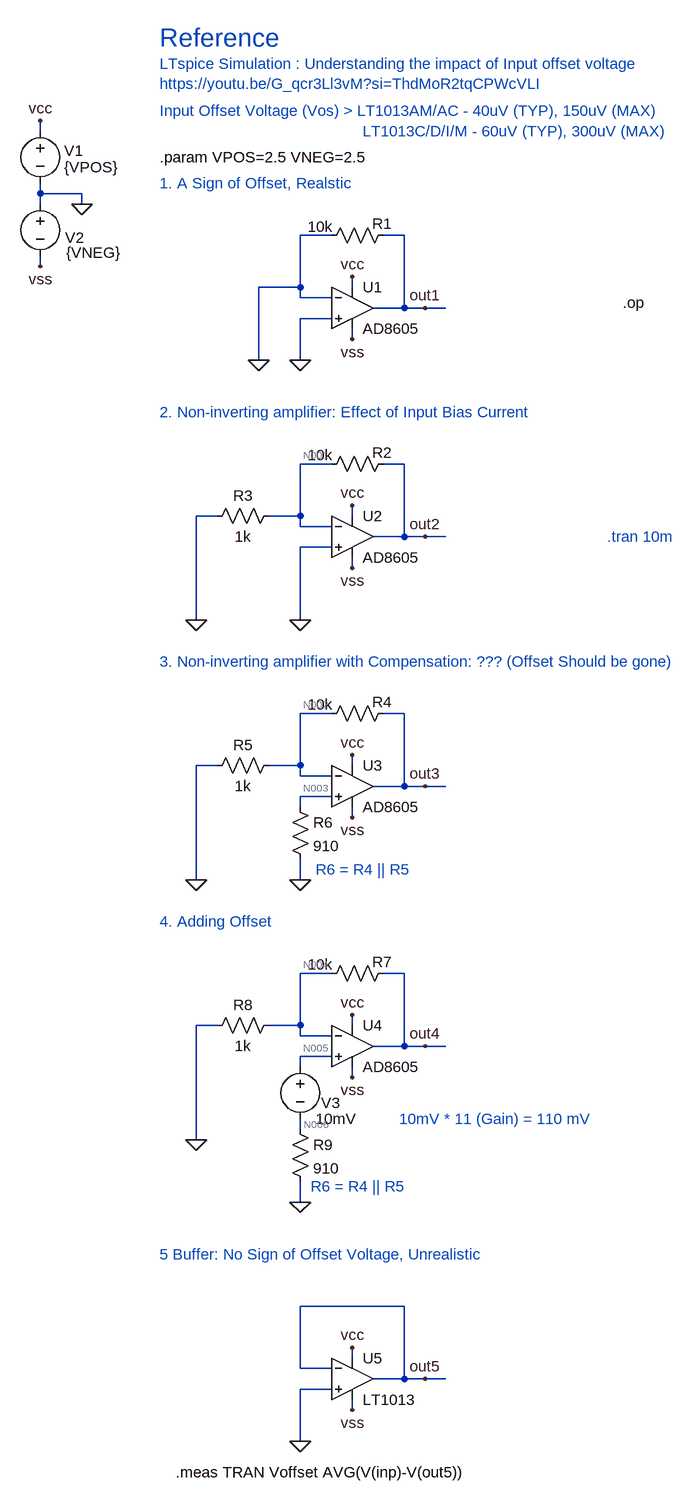
[diagram p0: schematic 05-AD8605_bias current.asc]
05-AD8605_bias current.asc, the LTspice schematic file:
Version 4
SHEET 1 1236 2280
WIRE -256 112 -256 96
WIRE -256 208 -256 192
WIRE -192 208 -256 208
WIRE -256 224 -256 208
WIRE -192 224 -192 208
WIRE 192 272 144 272
WIRE 304 272 272 272
WIRE -256 320 -256 304
WIRE 144 352 144 272
WIRE 144 352 80 352
WIRE 224 352 224 336
WIRE 144 368 144 352
WIRE 192 368 144 368
WIRE 304 384 304 272
WIRE 304 384 256 384
WIRE 336 384 304 384
WIRE 368 384 336 384
WIRE 192 400 144 400
WIRE 224 432 224 416
WIRE 80 464 80 352
WIRE 144 464 144 400
WIRE 192 624 144 624
WIRE 304 624 272 624
WIRE 16 704 -16 704
WIRE 144 704 144 624
WIRE 144 704 96 704
WIRE 224 704 224 688
WIRE 144 720 144 704
WIRE 192 720 144 720
WIRE 304 736 304 624
WIRE 304 736 256 736
WIRE 336 736 304 736
WIRE 368 736 336 736
WIRE 192 752 144 752
WIRE 224 784 224 768
WIRE -16 864 -16 704
WIRE 144 864 144 752
WIRE 192 1008 144 1008
WIRE 304 1008 272 1008
WIRE 16 1088 -16 1088
WIRE 144 1088 144 1008
WIRE 144 1088 96 1088
WIRE 224 1088 224 1072
WIRE 144 1104 144 1088
WIRE 192 1104 144 1104
WIRE 304 1120 304 1008
WIRE 304 1120 256 1120
WIRE 336 1120 304 1120
WIRE 368 1120 336 1120
WIRE 192 1136 144 1136
WIRE 144 1152 144 1136
WIRE 224 1168 224 1152
WIRE -16 1264 -16 1088
WIRE 144 1264 144 1232
WIRE 192 1408 144 1408
WIRE 304 1408 272 1408
WIRE 16 1488 -16 1488
WIRE 144 1488 144 1408
WIRE 144 1488 96 1488
WIRE 224 1488 224 1472
WIRE 144 1504 144 1488
WIRE 192 1504 144 1504
WIRE 304 1520 304 1408
WIRE 304 1520 256 1520
WIRE 336 1520 304 1520
WIRE 368 1520 336 1520
WIRE 192 1536 144 1536
WIRE 144 1552 144 1536
WIRE 224 1568 224 1552
WIRE 144 1648 144 1632
WIRE -16 1664 -16 1488
WIRE 144 1760 144 1728
WIRE 304 1920 144 1920
WIRE 224 2000 224 1984
WIRE 144 2016 144 1920
WIRE 192 2016 144 2016
WIRE 304 2032 304 1920
WIRE 304 2032 256 2032
WIRE 336 2032 304 2032
WIRE 368 2032 336 2032
WIRE 192 2048 144 2048
WIRE 224 2080 224 2064
WIRE 144 2128 144 2048
FLAG -192 224 0
FLAG -256 96 vcc
FLAG -256 320 vss
FLAG 224 336 vcc
FLAG 224 432 vss
FLAG 144 464 0
FLAG 336 384 out1
FLAG 80 464 0
FLAG 224 688 vcc
FLAG 224 784 vss
FLAG 144 864 0
FLAG 336 736 out2
FLAG -16 864 0
FLAG 224 1072 vcc
FLAG 224 1168 vss
FLAG 144 1264 0
FLAG 336 1120 out3
FLAG -16 1264 0
FLAG 224 1472 vcc
FLAG 224 1568 vss
FLAG 144 1760 0
FLAG 336 1520 out4
FLAG -16 1664 0
FLAG 224 1984 vcc
FLAG 144 2128 0
FLAG 336 2032 out5
FLAG 224 2080 vss
DATAFLAG 368 1120 "$"
DATAFLAG 368 736 "$"
DATAFLAG 368 384 "$"
DATAFLAG 368 1520 "$"
DATAFLAG 368 2032 "$"
DATAFLAG 144 2080 "$"
SYMBOL voltage -256 96 R0
WINDOW 0 37 46 Left 2
WINDOW 3 37 71 Left 2
SYMATTR InstName V1
SYMATTR Value {VPOS}
SYMBOL voltage -256 208 R0
WINDOW 0 38 68 Left 2
WINDOW 3 40 91 Left 2
SYMATTR InstName V2
SYMATTR Value {VNEG}
SYMBOL res 288 256 R90
WINDOW 0 14 18 VBottom 2
WINDOW 3 -13 113 VTop 2
SYMATTR InstName R1
SYMATTR Value 10k
SYMBOL res 288 608 R90
WINDOW 0 14 18 VBottom 2
WINDOW 3 -13 113 VTop 2
SYMATTR InstName R2
SYMATTR Value 10k
SYMBOL res 112 688 R90
WINDOW 0 0 56 VBottom 2
WINDOW 3 32 56 VTop 2
SYMATTR InstName R3
SYMATTR Value 1k
SYMBOL res 288 992 R90
WINDOW 0 14 18 VBottom 2
WINDOW 3 -13 113 VTop 2
SYMATTR InstName R4
SYMATTR Value 10k
SYMBOL res 112 1072 R90
WINDOW 0 0 56 VBottom 2
WINDOW 3 32 56 VTop 2
SYMATTR InstName R5
SYMATTR Value 1k
SYMBOL res 128 1136 R0
SYMATTR InstName R6
SYMATTR Value 910
SYMBOL res 288 1392 R90
WINDOW 0 14 18 VBottom 2
WINDOW 3 -13 113 VTop 2
SYMATTR InstName R7
SYMATTR Value 10k
SYMBOL res 112 1472 R90
WINDOW 0 0 56 VBottom 2
WINDOW 3 32 56 VTop 2
SYMATTR InstName R8
SYMATTR Value 1k
SYMBOL res 128 1632 R0
SYMATTR InstName R9
SYMATTR Value 910
SYMBOL voltage 144 1536 R0
WINDOW 0 32 71 Left 2
SYMATTR InstName V3
SYMATTR Value 10mV
SYMBOL OpAmps\\LT1013 224 1968 R0
SYMATTR InstName U5
SYMBOL OpAmps\\AD8605 224 320 R0
SYMATTR InstName U1
SYMBOL OpAmps\\AD8605 224 672 R0
SYMATTR InstName U2
SYMBOL OpAmps\\AD8605 224 1056 R0
SYMATTR InstName U3
SYMBOL OpAmps\\AD8605 224 1456 R0
SYMATTR InstName U4
TEXT -72 -32 Left 4 ;Reference
TEXT -72 8 Left 2 ;LTspice Simulation : Understanding the impact of Input offset voltage\nhttps://youtu.be/G_qcr3Ll3vM?si=ThdMoR2tqCPWcVLI
TEXT -72 192 Left 2 ;1. A Sign of Offset, Realstic
TEXT 616 736 Left 2 ;.tran 10m
TEXT -72 80 Left 2 ;Input Offset Voltage (Vos) > LT1013AM/AC - 40uV (TYP), 150uV (MAX)
TEXT 240 112 Left 2 ;LT1013C/D/I/M - 60uV (TYP), 300uV (MAX)
TEXT -72 544 Left 2 ;2. Non-inverting amplifier: Effect of Input Bias Current
TEXT 640 376 Left 2 !.op
TEXT -72 928 Left 2 ;3. Non-inverting amplifier with Compensation: ??? (Offset Should be gone)
TEXT 168 1248 Left 2 ;R6 = R4 || R5
TEXT -72 1328 Left 2 ;4. Adding Offset
TEXT 160 1736 Left 2 ;R6 = R4 || R5
TEXT 296 1632 Left 2 ;10mV * 11 (Gain) = 110 mV
TEXT -72 1840 Left 2 ;5 Buffer: No Sign of Offset Voltage, Unrealistic
TEXT -72 152 Left 2 !.param VPOS=2.5 VNEG=2.5
TEXT -48 2176 Left 2 !.meas TRAN Voffset AVG(V(inp)-V(out5))

The netlist it stands for:
* 05-AD8605_bias current.asc
V1 vcc 0 {VPOS}
V2 0 vss {VNEG}
R1 out1 0 10k
R2 out2 N001 10k
R3 N001 0 1k
R4 out3 N002 10k
R5 N002 0 1k
R6 N003 0 910
R7 out4 N004 10k
R8 N004 0 1k
R9 N006 0 910
V3 N005 N006 10mV
XU5 0 out5 vcc vss out5 LT1013  ; pins In+ In- V+ V- OUT
XU1 0 0 vcc vss out1 AD8605  ; pins In+ In- V+ V- OUT
XU2 0 N001 vcc vss out2 AD8605  ; pins In+ In- V+ V- OUT
XU3 N003 N002 vcc vss out3 AD8605  ; pins In+ In- V+ V- OUT
XU4 N005 N004 vcc vss out4 AD8605  ; pins In+ In- V+ V- OUT
* Reference
* LTspice Simulation : Understanding the impact of Input offset voltage
* https://youtu.be/G_qcr3Ll3vM?si=ThdMoR2tqCPWcVLI
* 1. A Sign of Offset, Realstic
* .tran 10m
* Input Offset Voltage (Vos) > LT1013AM/AC - 40uV (TYP), 150uV (MAX)
* LT1013C/D/I/M - 60uV (TYP), 300uV (MAX)
* 2. Non-inverting amplifier: Effect of Input Bias Current
.op
* 3. Non-inverting amplifier with Compensation: ??? (Offset Should be gone)
* R6 = R4 || R5
* 4. Adding Offset
* R6 = R4 || R5
* 10mV * 11 (Gain) = 110 mV
* 5 Buffer: No Sign of Offset Voltage, Unrealistic
.param VPOS=2.5 VNEG=2.5
.meas TRAN Voffset AVG(V(inp)-V(out5))
.lib LTC.lib
.lib ADI.lib
.backanno
.end

* Results of the author's LTspice run, read from the files saved beside the schematic
* Operating Point:
*   V(vcc) = 2.5 V
*   V(vss) = -2.5 V
*   V(out1) = -2.494 V
*   V(out2) = -868 µV
*   V(n001) = -78.91 µV
*   V(out3) = -868 µV
*   V(n002) = -78.91 µV
*   V(n003) = -45.5 pV
*   V(out4) = 109.1 mV
*   V(n004) = 9.921 mV
*   V(n006) = -45.5 pV
*   V(n005) = 10 mV
*   V(out5) = 112.5 fV
*   I(R1) = -249.4 µA
*   I(R2) = -78.91 nA
*   I(R3) = -78.91 nA
*   I(R4) = -78.91 nA
*   I(R5) = -78.91 nA
*   I(R6) = -50 fA
*   I(R7) = 9.921 µA
*   I(R8) = 9.921 µA
*   I(R9) = -50 fA
*   I(V1) = -2.423 mA
*   I(V2) = -2.662 mA
*   I(V3) = -50 fA
* From the log:
*   Semiconductor Device Operating Points:
*                           --- Diodes ---
*   Name:    d:u5:1      d:u5:4      d:u5:5      d:u5:6      d:u5:2
*   Model:    u5:xu       u5:xd       u5:yu       u5:yd     u5:dbias
*   Id:     -2.50e-11   -2.50e-11   -8.58e-19    8.58e-19   -1.20e-08
*   Vd:     -2.50e+00   -2.50e+00   -8.57e-07    8.57e-07   -2.50e+00
*   Req:     1.00e-11    1.00e-11    1.00e-12    1.00e-12    1.00e-03
*   CAP:     0.00e+00    0.00e+00    0.00e+00    0.00e+00    0.00e+00
*   Name:    d:u5:3      d:u1:1      d:u1:2      d:u1:3      d:u1:4
*   Model:  u5:dbias      u1:dx       u1:dx       u1:dx       u1:dx
*   Id:     -1.20e-08   -1.80e-12   -1.80e-12    4.13e-08   -4.20e-12
*   Vd:     -2.50e+00   -1.79e+00   -1.79e+00    3.94e-01   -4.19e+00
*   Req:     1.00e-03    1.00e+12    1.00e+12    6.27e+05    1.00e+12
*   CAP:     0.00e+00    0.00e+00    0.00e+00    0.00e+00    0.00e+00
*   Name:    d:u2:1      d:u2:2      d:u2:3      d:u2:4      d:u3:1
*   Model:    u2:dx       u2:dx       u2:dx       u2:dx       u3:dx
*   Id:     -1.80e-12   -1.80e-12   -1.91e-12   -1.91e-12   -1.80e-12
*   Vd:     -1.79e+00   -1.79e+00   -1.90e+00   -1.90e+00   -1.79e+00
*   Req:     1.00e+12    1.00e+12    1.00e+12    1.00e+12    1.00e+12
*   CAP:     0.00e+00    0.00e+00    0.00e+00    0.00e+00    0.00e+00
*   Name:    d:u3:2      d:u3:3      d:u3:4      d:u4:1      d:u4:2
*   Model:    u3:dx       u3:dx       u3:dx       u4:dx       u4:dx
*   Id:     -1.80e-12   -1.91e-12   -1.91e-12   -1.79e-12   -1.81e-12
*   Vd:     -1.79e+00   -1.90e+00   -1.90e+00   -1.78e+00   -1.80e+00
*   Req:     1.00e+12    1.00e+12    1.00e+12    1.00e+12    1.00e+12
*   CAP:     0.00e+00    0.00e+00    0.00e+00    0.00e+00    0.00e+00
*   Name:    d:u4:3      d:u4:4
*   Model:    u4:dx       u4:dx
*   Id:     -1.91e-12   -1.91e-12
*   Vd:     -1.90e+00   -1.90e+00
*   Req:     1.00e+12    1.00e+12
*   CAP:     0.00e+00    0.00e+00
*                           --- VDMOSFET Transistors ---
*   Name:        m:u5:1      m:u5:2
*   Model:        u5:n        u5:p
*   Id:          3.50e-04   -3.50e-04
*   Vgs:        -8.57e-07   -8.57e-07
*   Vds:         2.50e+00   -2.50e+00
*   Vth:        -1.00e-01    1.00e-01
*   Gm:          7.00e-03    7.00e-03
*   Gds:         0.00e+00    0.00e+00
*   Cgs:         0.00e+00    0.00e+00
*   Cgd:         0.00e+00    0.00e+00
*   Cbody:       0.00e+00    0.00e+00
*                           --- MOSFET Transistors ---
*   Name:        m:u1:1      m:u1:2      m:u1:3      m:u1:4      m:u1:5
*   Model:       u1:pix      u1:pix      u1:nix      u1:nix      u1:pox
*   Id:         -5.01e-05   -4.99e-05    4.99e-05    5.01e-05   -1.00e-11
*   Vgs:        -4.06e-01   -4.06e-01    4.06e-01    4.06e-01    1.83e+00
*   Vds:        -2.71e+00   -2.71e+00    2.71e+00    2.71e+00   -4.99e+00
*   Vbs:         0.00e+00    0.00e+00    0.00e+00    0.00e+00    0.00e+00
*   Vth:        -3.28e-01   -3.28e-01    3.28e-01    3.28e-01   -3.28e-01
*   Vdsat:      -7.80e-02   -7.79e-02    7.79e-02    7.80e-02   -0.00e+00
*   Gm:          1.28e-03    1.28e-03    1.28e-03    1.28e-03    0.00e+00
*   Gds:         5.14e-07    5.13e-07    5.13e-07    5.14e-07    0.00e+00
*   Gmb:         0.00e+00    0.00e+00    0.00e+00    0.00e+00    0.00e+00
*   Cbd:         0.00e+00    0.00e+00    0.00e+00    0.00e+00    0.00e+00
*   Cbs:         0.00e+00    0.00e+00    0.00e+00    0.00e+00    0.00e+00
*   Cgsov:       0.00e+00    0.00e+00    0.00e+00    0.00e+00    0.00e+00
*   Cgdov:       0.00e+00    0.00e+00    0.00e+00    0.00e+00    0.00e+00
*   Cgbov:       0.00e+00    0.00e+00    0.00e+00    0.00e+00    0.00e+00
*   Cgs:         3.68e-19    3.68e-19    3.68e-19    3.68e-19    0.00e+00
*   Cgd:         0.00e+00    0.00e+00    0.00e+00    0.00e+00    0.00e+00
*   Cgb:         0.00e+00    0.00e+00    0.00e+00    0.00e+00    3.73e-13
*   Name:        m:u1:6      m:u2:1      m:u2:2      m:u2:3      m:u2:4
*   Model:       u1:nox      u2:pix      u2:pix      u2:nix      u2:nix
*   Id:          2.49e-04   -5.00e-05   -5.00e-05    5.00e-05    5.00e-05
*   Vgs:         2.73e+00   -4.06e-01   -4.06e-01    4.06e-01    4.06e-01
*   Vds:         6.45e-03   -2.71e+00   -2.71e+00    2.71e+00    2.71e+00
*   Vbs:         0.00e+00    0.00e+00    0.00e+00    0.00e+00    0.00e+00
*   Vth:         3.28e-01   -3.28e-01   -3.28e-01    3.28e-01    3.28e-01
*   Vdsat:       2.41e+00   -7.80e-02   -7.80e-02    7.80e-02    7.80e-02
*   Gm:          1.04e-04    1.28e-03    1.28e-03    1.28e-03    1.28e-03
*   Gds:         3.86e-02    5.14e-07    5.14e-07    5.14e-07    5.14e-07
*   Gmb:         0.00e+00    0.00e+00    0.00e+00    0.00e+00    0.00e+00
*   Cbd:         0.00e+00    0.00e+00    0.00e+00    0.00e+00    0.00e+00
*   Cbs:         0.00e+00    0.00e+00    0.00e+00    0.00e+00    0.00e+00
*   Cgsov:       0.00e+00    0.00e+00    0.00e+00    0.00e+00    0.00e+00
*   Cgdov:       0.00e+00    0.00e+00    0.00e+00    0.00e+00    0.00e+00
*   Cgbov:       0.00e+00    0.00e+00    0.00e+00    0.00e+00    0.00e+00
*   Cgs:         2.78e-13    3.68e-19    3.68e-19    3.68e-19    3.68e-19
*   Cgd:         2.78e-13    0.00e+00    0.00e+00    0.00e+00    0.00e+00
*   Cgb:         0.00e+00    0.00e+00    0.00e+00    0.00e+00    0.00e+00
*   Name:        m:u2:5      m:u2:6      m:u3:1      m:u3:2      m:u3:3
*   Model:       u2:pox      u2:nox      u3:pix      u3:pix      u3:nix
*   Id:         -1.03e-04    1.03e-04   -5.00e-05   -5.00e-05    5.00e-05
*   Vgs:        -4.64e-01    4.40e-01   -4.06e-01   -4.06e-01    4.06e-01
*   Vds:        -2.50e+00    2.50e+00   -2.71e+00   -2.71e+00    2.71e+00
*   Vbs:         0.00e+00    0.00e+00    0.00e+00    0.00e+00    0.00e+00
*   Vth:        -3.28e-01    3.28e-01   -3.28e-01   -3.28e-01    3.28e-01
*   Vdsat:      -1.36e-01    1.12e-01   -7.80e-02   -7.80e-02    7.80e-02
*   Gm:          1.51e-03    1.84e-03    1.28e-03    1.28e-03    1.28e-03
*   Gds:         1.05e-06    1.05e-06    5.14e-07    5.14e-07    5.14e-07
*   Gmb:         0.00e+00    0.00e+00    0.00e+00    0.00e+00    0.00e+00
*   Cbd:         0.00e+00    0.00e+00    0.00e+00    0.00e+00    0.00e+00
*   Cbs:         0.00e+00    0.00e+00    0.00e+00    0.00e+00    0.00e+00
*   Cgsov:       0.00e+00    0.00e+00    0.00e+00    0.00e+00    0.00e+00
*   Cgdov:       0.00e+00    0.00e+00    0.00e+00    0.00e+00    0.00e+00
*   Cgbov:       0.00e+00    0.00e+00    0.00e+00    0.00e+00    0.00e+00
*   Cgs:         2.49e-13    3.71e-13    3.68e-19    3.68e-19    3.68e-19
*   Cgd:         0.00e+00    0.00e+00    0.00e+00    0.00e+00    0.00e+00
*   Cgb:         0.00e+00    0.00e+00    0.00e+00    0.00e+00    0.00e+00
*   Name:        m:u3:4      m:u3:5      m:u3:6      m:u4:1      m:u4:2
*   Model:       u3:nix      u3:pox      u3:nox      u4:pix      u4:pix
*   Id:          5.00e-05   -1.03e-04    1.03e-04   -5.00e-05   -5.00e-05
*   Vgs:         4.06e-01   -4.64e-01    4.40e-01   -4.06e-01   -4.06e-01
*   Vds:         2.71e+00   -2.50e+00    2.50e+00   -2.72e+00   -2.72e+00
*   Vbs:         0.00e+00    0.00e+00    0.00e+00    0.00e+00    0.00e+00
*   Vth:         3.28e-01   -3.28e-01    3.28e-01   -3.28e-01   -3.28e-01
*   Vdsat:       7.80e-02   -1.36e-01    1.12e-01   -7.80e-02   -7.80e-02
*   Gm:          1.28e-03    1.51e-03    1.84e-03    1.28e-03    1.28e-03
*   Gds:         5.14e-07    1.05e-06    1.05e-06    5.14e-07    5.14e-07
*   Gmb:         0.00e+00    0.00e+00    0.00e+00    0.00e+00    0.00e+00
*   Cbd:         0.00e+00    0.00e+00    0.00e+00    0.00e+00    0.00e+00
*   Cbs:         0.00e+00    0.00e+00    0.00e+00    0.00e+00    0.00e+00
*   Cgsov:       0.00e+00    0.00e+00    0.00e+00    0.00e+00    0.00e+00
*   Cgdov:       0.00e+00    0.00e+00    0.00e+00    0.00e+00    0.00e+00
*   Cgbov:       0.00e+00    0.00e+00    0.00e+00    0.00e+00    0.00e+00
*   Cgs:         3.68e-19    2.49e-13    3.71e-13    3.68e-19    3.68e-19
*   Cgd:         0.00e+00    0.00e+00    0.00e+00    0.00e+00    0.00e+00
*   Cgb:         0.00e+00    0.00e+00    0.00e+00    0.00e+00    0.00e+00
*   Name:        m:u4:3      m:u4:4      m:u4:5      m:u4:6
*   Model:       u4:nix      u4:nix      u4:pox      u4:nox
*   Id:          5.00e-05    5.00e-05   -1.07e-04    9.74e-05
*   Vgs:         4.06e-01    4.06e-01   -4.67e-01    4.37e-01
*   Vds:         2.70e+00    2.70e+00   -2.39e+00    2.61e+00
*   Vbs:         0.00e+00    0.00e+00    0.00e+00    0.00e+00
*   Vth:         3.28e-01    3.28e-01   -3.28e-01    3.28e-01
*   Vdsat:       7.80e-02    7.80e-02   -1.39e-01    1.09e-01
*   Gm:          1.28e-03    1.28e-03    1.54e-03    1.79e-03
*   Gds:         5.14e-07    5.14e-07    1.10e-06    1.00e-06
*   Gmb:         0.00e+00    0.00e+00    0.00e+00    0.00e+00
*   Cbd:         0.00e+00    0.00e+00    0.00e+00    0.00e+00
*   Cbs:         0.00e+00    0.00e+00    0.00e+00    0.00e+00
*   Cgsov:       0.00e+00    0.00e+00    0.00e+00    0.00e+00
*   Cgdov:       0.00e+00    0.00e+00    0.00e+00    0.00e+00
*   Cgbov:       0.00e+00    0.00e+00    0.00e+00    0.00e+00
*   Cgs:         3.68e-19    3.68e-19    2.49e-13    3.71e-13
*   Cgd:         0.00e+00    0.00e+00    0.00e+00    0.00e+00
*   Cgb:         0.00e+00    0.00e+00    0.00e+00    0.00e+00